# EAGLE design DC_Sensor_ESP8266_ADC_NC_08 (EAGLE 7.5.0)
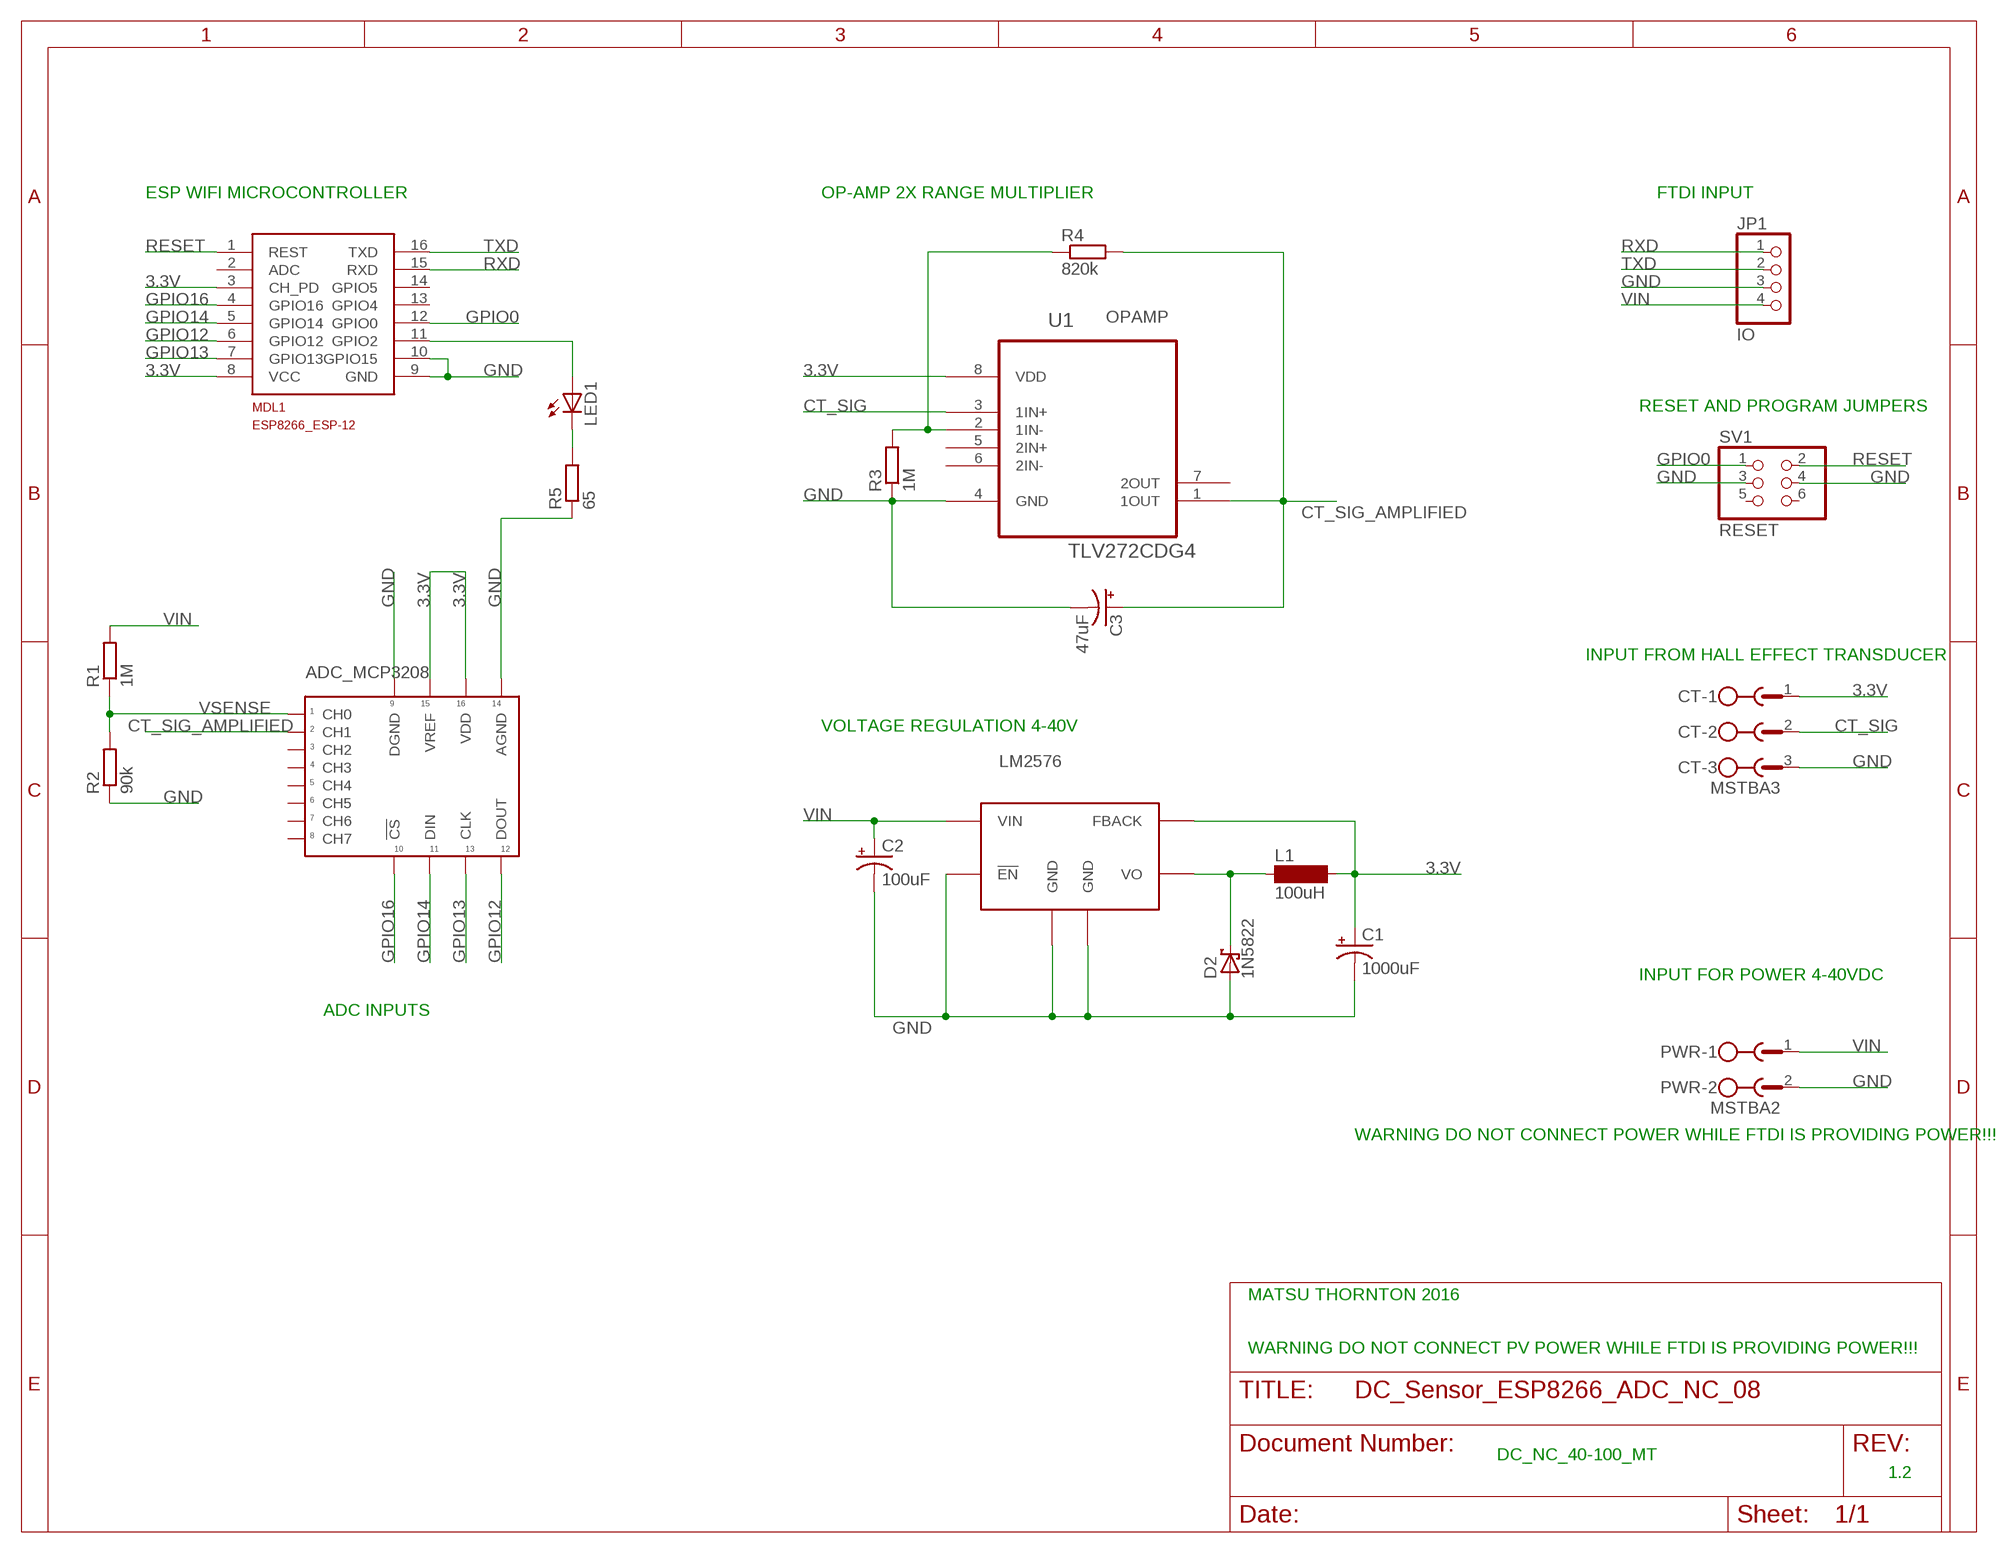
[diagram p0: schematic, sheet 1]

## Parts
ADC_MCP3208  21298ESMD  [PDIP16]
C1  1000uF  CPOL-USF  [PANASONIC_F]
C2  100uF  CPOL-USF  [PANASONIC_F]
C3  47uF  CPOL-USC  [PANASONIC_C]
CT  MSTBA3  [MSTBA3]
D2  1N5822  SCHOTTKY-DIODEC4111-15  [C4111-15]
JP1  IO  PINHD-1X4  [1X04]
L1  100uH  BS11  [BS11]
LED1  LEDCHIP-LED0603  [CHIP-LED0603]
LM2576  LM2576S  [TO263-5]
MDL1  ESP8266-12GPIO04/05_CORRECTED  [ESP8266-ESP12]
PWR  MSTBA2  [MSTBA2]
R1  1M  R-EU_R0805  [R0805]
R2  90k  R-EU_R0805  [R0805]
R3  1M  R-EU_R0805  [R0805]
R4  820k  R-EU_R0805  [R0805]
R5  65  R-EU_R0805  [R0805]
SV1  RESET  PINHD-2X3  [2X03]
U1  TLV272CDG4  [SOIC127P600X175-8N]

## Nets
3.3V: ADC_MCP3208.P$15(VREF) ADC_MCP3208.P$16(VDD) C1.+ CT.1 L1.2 LM2576.4(FBACK) MDL1.3(CH_PD) MDL1.8(VCC) U1.8(VDD)
CT_SIG: CT.2 U1.3(1IN+)
CT_SIG_AMPLIFIED: ADC_MCP3208.P$2(CH1) C3.+ R4.2 U1.1(1OUT)
GND: ADC_MCP3208.P$9(DGND) ADC_MCP3208.P$14(AGND) C1.- C2.- C3.- CT.3 D2.A JP1.3 LM2576.3(GND) LM2576.5(!EN) LM2576.TAB(GND) MDL1.9(GND) MDL1.10(GPIO15) PWR.2 R2.1 R3.1 R5.1 SV1.3 SV1.4 U1.4(GND)
GPIO0: MDL1.12(GPIO0) SV1.1
GPIO12: ADC_MCP3208.P$12(DOUT) MDL1.6(GPIO12)
GPIO13: ADC_MCP3208.P$13(CLK) MDL1.7(GPIO13)
GPIO14: ADC_MCP3208.P$11(DIN) MDL1.5(GPIO14)
GPIO16: ADC_MCP3208.P$10(!CS) MDL1.4(GPIO16)
N$1: LED1.A MDL1.11(GPIO2)
N$2: R3.2 R4.1 U1.2(1IN-)
N$3: LED1.C R5.2
N$4: D2.C L1.1 LM2576.2(VO)
RESET: MDL1.1(REST) SV1.2
RXD: JP1.1 MDL1.15(RXD)
TXD: JP1.2 MDL1.16(TXD)
VIN: C2.+ JP1.4 LM2576.1(VIN) PWR.1 R1.2
VSENSE: ADC_MCP3208.P$1(CH0) R1.1 R2.2
Unconnected: ADC_MCP3208.P$3(CH2) ADC_MCP3208.P$4(CH3) ADC_MCP3208.P$5(CH4) ADC_MCP3208.P$6(CH5) ADC_MCP3208.P$7(CH6) ADC_MCP3208.P$8(CH7) MDL1.2(ADC) MDL1.13(GPIO4) MDL1.14(GPIO5) SV1.5 SV1.6 U1.5(2IN+) U1.6(2IN-) U1.7(2OUT)

## Notes on the sheet
- ESP WIFI MICROCONTROLLER | OP-AMP 2X RANGE MULTIPLIER | FTDI INPUT
- RESET AND PROGRAM JUMPERS
- INPUT FROM HALL EFFECT TRANSDUCER
- VOLTAGE REGULATION 4-40V
- INPUT FOR POWER 4-40VDC
- ADC INPUTS
- WARNING DO NOT CONNECT POWER WHILE FTDI IS PROVIDING POWER!!!
- MATSU THORNTON 2016
- WARNING DO NOT CONNECT PV POWER WHILE FTDI IS PROVIDING POWER!!!
- DC_NC_40-100_MT
- 1.2

## Library data of the parts
ADC_MCP3208 = MCP3208:21298E
C1-C3 = rcl:CPOL-US: POLARIZED CAPACITOR, American symbol
CT = con-phoenix-508:MSTBA3: PHOENIX; MF: FARNELL; MPN: 1757255; OC_FARNELL: 3705183; OC_NEWARK: 71C4162
D2 = diode:SCHOTTKY-DIODE: Schottky Diode
JP1 = pinhead:PINHD-1X4: PIN HEADER
L1 = inductor-neosid:BS: INDUCTOR nominal inductance, magnetically screened; OC_FARNELL: unknown; OC_NEWARK: unknown
LED1 = led:LED: LED OSRAM: - CHIPLED LG R971, LG N971, LY N971, LG Q971, LY Q971, LO R971, LY R971 LH N974, LH R974 LS Q976, LO Q976, LY Q976 LO Q996 - Hyper CHIPLED LW Q18S LB Q993, LB Q99A, LB R99A - SideLED LS A670, LO A670, LY A670, LG A670, LP A670 LB A673, LV A673, LT A673, LW A673 LH A674 LY A675 LS A676, LA A676, LO A676, LY A676, LW A676 LS A679, LY A679, LG A679 - Hyper Micro SIDELED® LS Y876, LA Y876, LO Y876, LY Y876 LT Y87S - SmartLED LW L88C, LW L88S LB L89C, LB L89S, LG L890 LS L89K, LO L89K, LY L89K LS L896, LA L896, LO L896, LY L896 - TOPLED LS T670, LO T670, LY T670, LG T670, LP T670 LSG T670, LSP T670, LSY T670, LOP T670, LYG T670 LG T671, LOG T671, LSG T671 LB T673, LV T673, LT T673, LW T673 LH T674 LS T676, LA T676, LO T676, LY T676, LB T676, LH T676, LSB T676, LW T676 LB T67C, LV T67C, LT T67C, LS T67K, LO T67K, LY T67K, LW E67C LS E67B, LA E67B, LO E67B, LY E67B, LB E67C, LV E67C, LT E67C LW T67C LS T679, LY T679, LG T679 LS T770, LO T770, LY T770, LG T770, LP T770 LB T773, LV T773, LT T773, LW T773 LH T774 LS E675, LA E675, LY E675, LS T675 LS T776, LA T776, LO T776, LY T776, LB T776 LHGB T686 LT T68C, LB T68C - Hyper Mini TOPLED® LB M676 - Mini TOPLED Santana® LG M470 LS M47K, LO M47K, LY M47K Source: http://www.osram.convergy.de LUXEON: - LUMILED® LXK2-PW12-R00, LXK2-PW12-S00, LXK2-PW14-U00, LXK2-PW14-V00 LXK2-PM12-R00, LXK2-PM12-S00, LXK2-PM14-U00 LXK2-PE12-Q00, LXK2-PE12-R00, LXK2-PE12-S00, LXK2-PE14-T00, LXK2-PE14-U00 LXK2-PB12-K00, LXK2-PB12-L00, LXK2-PB12-M00, LXK2-PB14-N00, LXK2-PB14-P00, LXK2-PB14-Q00 LXK2-PR12-L00, LXK2-PR12-M00, LXK2-PR14-Q00, LXK2-PR14-R00 LXK2-PD12-Q00, LXK2-PD12-R00, LXK2-PD12-S00 LXK2-PH12-R00, LXK2-PH12-S00 LXK2-PL12-P00, LXK2-PL12-Q00, LXK2-PL12-R00 Source: www.luxeon.com KINGBRIGHT: KA-3528ASYC Source: www.kingbright.com
LM2576 = AWJLEagleLib:LM2576: Texas Instruments LM2576 Simple Switcher
MDL1 = ESP8266-ESP12:ESP8266-12: Espressif ESP8266 ESP-12 Module with GPIO04 and GPIO05 corrected.
PWR = con-phoenix-508:MSTBA2: PHOENIX; MF: FARNELL; MPN: 1757242; OC_FARNELL: 3705171; OC_NEWARK: 71C4161
R1-R5 = rcl:R-EU_: RESISTOR, European symbol
SV1 = pinhead:PINHD-2X3: PIN HEADER
U1 = Texas Instruments_By_element14_Batch_1:TLV272CDG4: OPERATIONAL AMPLIFIERS; MPN: TLV272CDG4; OC_FARNELL: 1234856; OC_NEWARK: 13M5572; PACKAGE: SOIC-8; SUPPLIER: TI; TYPE: OPAMP

## Board
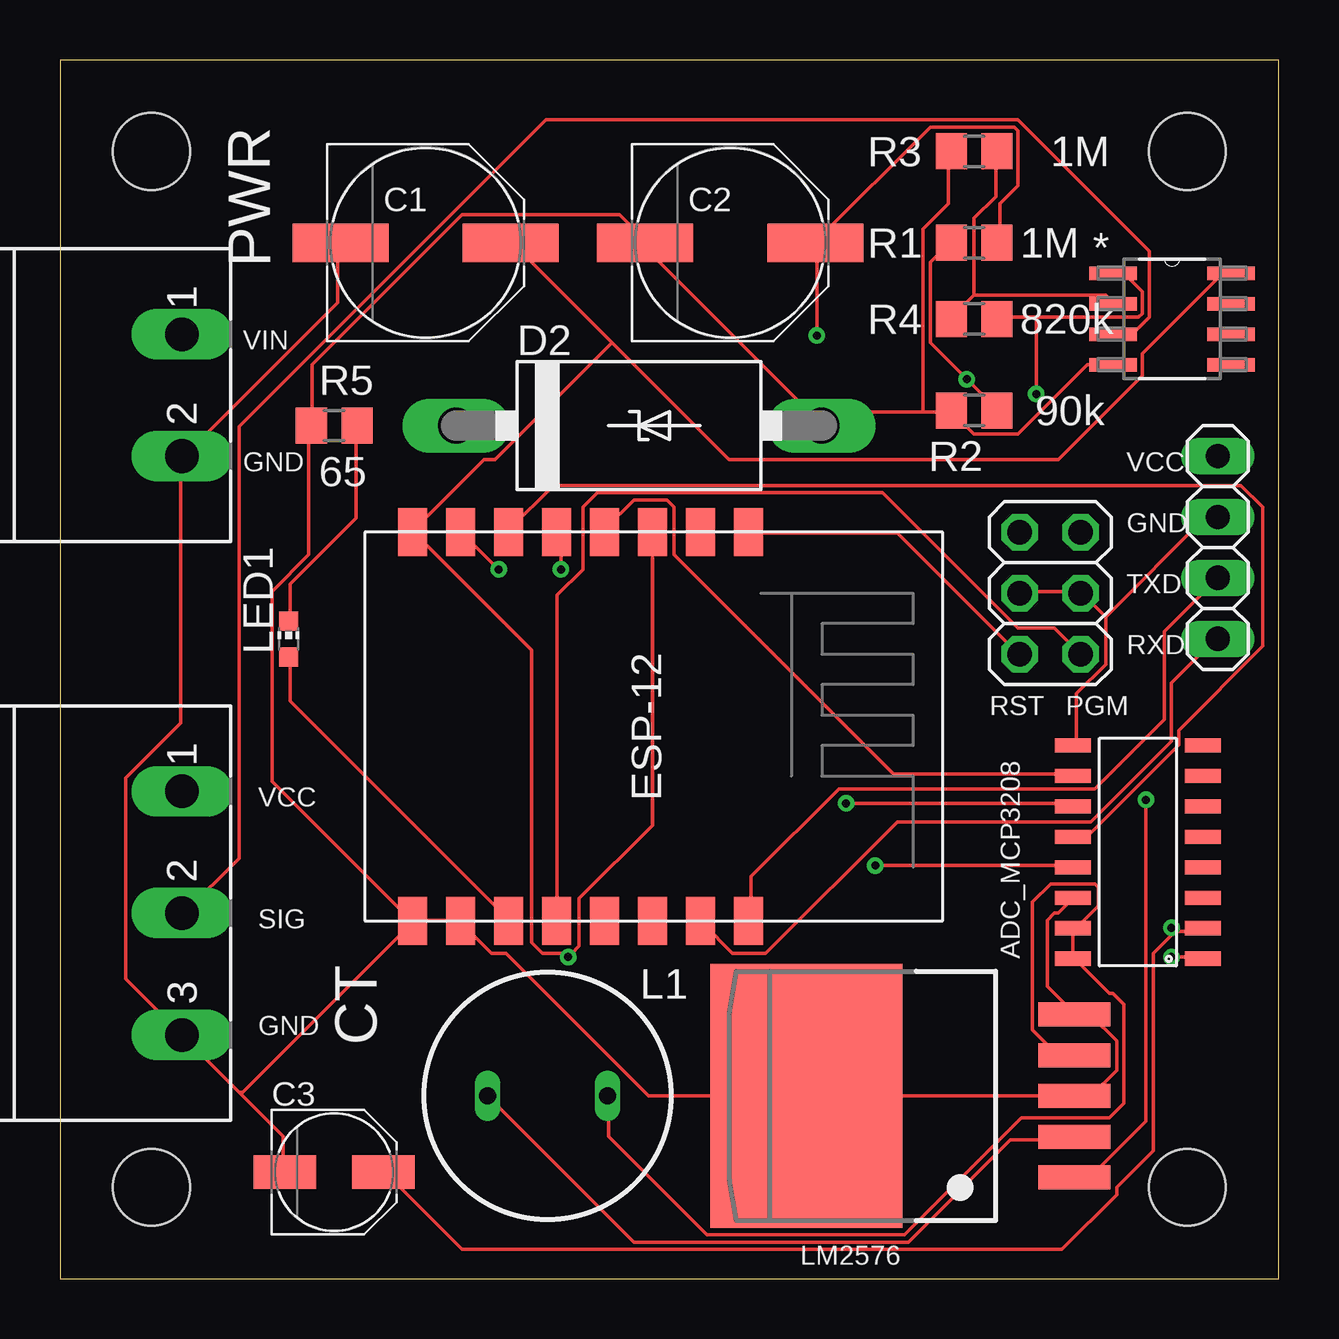
[diagram p1: board, top side]
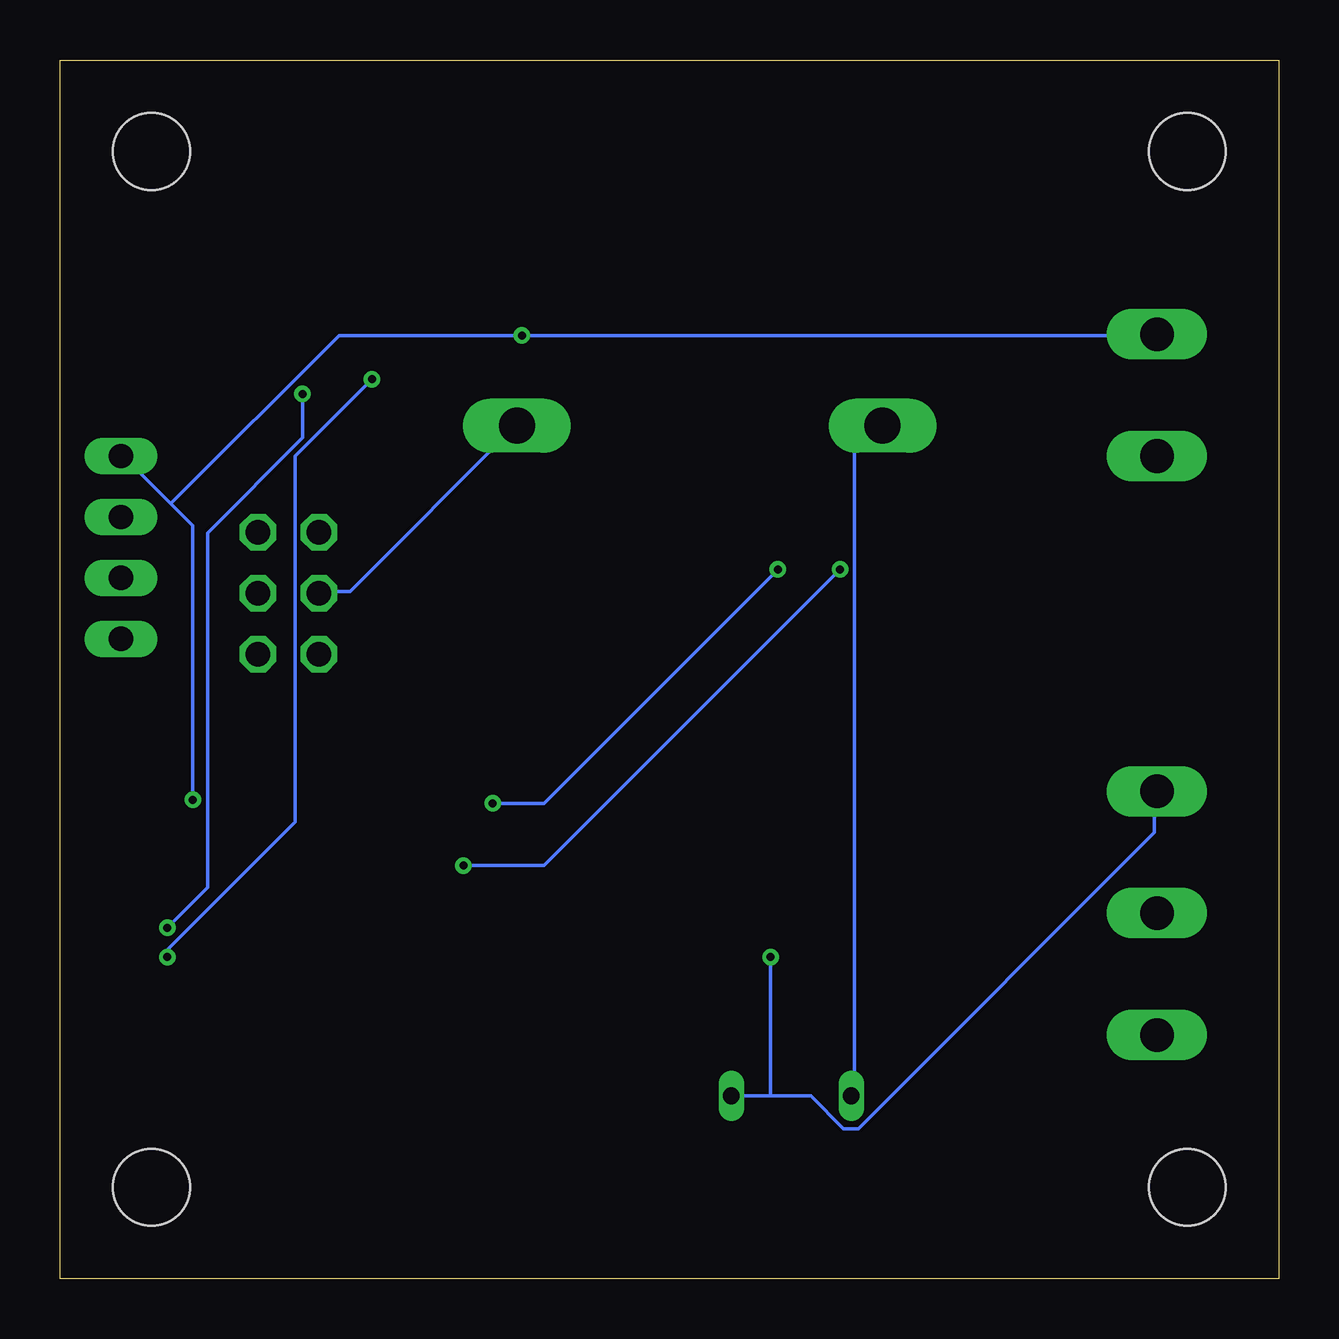
[diagram p2: board, bottom side, seen from below]

Size 50.8 x 50.8 mm. Coordinates in mm from the lower left corner, seen from the top.
Outline: 0,0 50.8,0 50.8,50.8 0,50.8 0,0
Copper layers (1*16): Top 0.0356mm / dielectric 1.5011mm / Bottom 0.0356mm
Design rules "LaenPCBOrder": minimum track width 6mil, minimum drill 13mil, track to track 6mil, track to pad 6mil, pad to pad 6mil, via to via 6mil, smd to smd 6mil, copper to edge 15mil, drill to drill 6mil, minimum pad ring 7mil, minimum via ring 7mil, stop-mask expansion 3mil, vias tented up to drill 0mil, thermal gap 10mil
Holes 3.2 mm at 3.81,46.99 46.99,46.99 46.99,3.81 3.81,3.81

### Footprints (pad centres in the part's own frame; a part is rotated, then mirrored left to right if it is on the bottom)
PDIP16 = smd 0.6 x 1.5: P$1 0,0; P$2 1.27,0; P$3 2.54,0; P$4 3.81,0; P$5 5.08,0; P$6 6.35,0; P$7 7.62,0; P$8 8.89,0; P$9 8.89,5.4; P$10 7.62,5.4; P$11 6.35,5.4; P$12 5.08,5.4; P$13 3.81,5.4; P$14 2.54,5.4; P$15 1.27,5.4; P$16 0,5.4
PANASONIC_F = smd 4 x 1.6: + 3.55,0; - -3.55,0
PANASONIC_C = smd 2.6 x 1.4: + 2.05,0; - -2.05,0
MSTBA3 = drill 1.397 long: 1 -5.08,5.08; 2 0,5.08; 3 5.08,5.08
C4111-15 = drill 1.499 long: A 7.62,0; C -7.62,0
1X04 = drill 1.016 long: 1 -3.81,0; 2 -1.27,0; 3 1.27,0; 4 3.81,0
BS11 = drill 0.7 long: 1 -2.5,0; 2 2.5,0
CHIP-LED0603 = smd 0.8 x 0.8: A 0,-0.75; C 0,0.75
TO263-5 = smd 1 x 3: 1 -3.4,-8; 2 -1.7,-8; 3 0,-8; 4 1.7,-8; 5 3.4,-8 | smd 11 x 8: TAB 0,3.175
ESP8266-ESP12 = smd 2 x 1.2: 1 0,16; 2 0,14; 3 0,12; 4 0,10; 5 0,8; 6 0,6; 7 0,4; 8 0,2; 9 16.2,2; 10 16.2,4; 11 16.2,6; 12 16.2,8; 13 16.2,10; 14 16.2,12; 15 16.2,14; 16 16.2,16
MSTBA2 = drill 1.397 long: 1 -2.54,5.08; 2 2.54,5.08
R0805 = smd 1.3 x 1.5: 1 -0.95,0; 2 0.95,0
2X03 = drill 1.016 octagon: 1 -2.54,-1.27; 2 -2.54,1.27; 3 0,-1.27; 4 0,1.27; 5 2.54,-1.27; 6 2.54,1.27
SOIC127P600X175-8N = smd 1.981 x 0.559: 1 -2.464,1.905; 2 -2.464,0.635; 3 -2.464,-0.635; 4 -2.464,-1.905; 5 2.464,-1.905; 6 2.464,-0.635; 7 2.464,0.635; 8 2.464,1.905

### Placement (x,y rotation side)
ADC_MCP3208  47.62,13.34 90 top
C1  15.24,43.18 0 top
C2  27.94,43.18 0 top
C3  11.43,4.45 0 top
CT  0,15.24 270 top
D2  24.13,35.56 0 top
JP1  48.26,30.48 90 top
L1  20.32,7.62 0 top
LED1  9.53,26.67 0 top
LM2576  34.29,7.62 90 top
MDL1  12.7,31.11 270 top
PWR  0,36.83 270 top
R1  38.1,43.18 0 top
R2  38.1,36.2 0 top
R3  38.1,46.99 0 top
R4  38.1,40.01 0 top
R5  11.43,35.56 0 top
SV1  41.27,28.57 90 top
U1  46.35,40.01 0 top

### Tracks (layer width: path | path; a pad name or v marks a point on that pad's centre or on a via)
3.3V  (via drill 0.33)
  Top 0.152: LM2576.4 42.22,9.45 41.45,9.45 40.54,10.36 40.54,15.7 41.3,16.46 43.13,16.46 43.28,16.31 43.28,15.54 42.37,14.63 ADC_MCP3208.P$15 42.22,14.48 42.22,13.41 ADC_MCP3208.P$16 42.37,13.26 43.74,11.89 43.89,11.89 44.35,11.43 44.35,7.32 43.74,6.71 40.08,6.71 35.2,1.83 26.98,1.83 22.86,5.94 22.86,7.62 L1.2 | U1.8 48.46,41.91 45.11,38.56 45.11,37.64 41.6,34.14 27.89,34.14 23.01,39.01 | 23.01,39.01 18.9,43.13 C1.+ | 23.01,39.01 18.14,34.14 17.68,34.14 14.78,31.24 MDL1.8 14.78,31.09 19.66,26.21 19.66,14.02 20.12,13.56 21.18,13.56 | 21.18,13.56 21.34,13.56 21.64,13.87 21.64,15.85 24.69,18.9 24.69,31.09 MDL1.3 | 21.18,13.56 v21.18,13.41
  Bottom 0.152: 21.18,7.62 19.51,7.62 18.14,6.25 17.53,6.25 5.18,18.59 5.18,20.27 CT.1 | 21.18,7.62 L1.2 | v21.18,13.41 21.18,7.62
CT_SIG
  Top 0.152: U1.3 43.89,39.47 44.81,39.47 45.41,40.08 45.41,42.82 39.93,48.31 20.27,48.31 7.47,35.51 7.47,17.53 5.18,15.24 CT.2
CT_SIG_AMPLIFIED  (via drill 0.33)
  Top 0.152: 40.69,40.08 44.96,40.08 45.11,40.23 45.11,41.15 44.35,41.91 U1.1 | 40.69,40.08 39.17,40.08 R4.2 | 46.48,14.48 47.55,14.48 ADC_MCP3208.P$2 | 46.48,14.48 45.57,13.56 45.57,5.33 44.04,3.81 44.04,3.5 41.76,1.22 16.76,1.22 13.56,4.42 C3.+ | v40.69,36.88 40.69,40.08 | 46.48,14.48 v46.33,14.63
  Bottom 0.152: v40.69,36.88 40.69,35.05 44.65,31.09 44.65,16.31 v46.33,14.63
GND
  Top 0.152: 43.59,27.58 43.59,25.6 42.37,24.38 42.37,22.25 ADC_MCP3208.P$9 | 43.59,27.58 42.67,28.5 SV1.3 42.52,28.65 40.08,28.65 SV1.4 | 43.59,27.58 47.7,31.7 48.16,31.7 JP1.3 | 35.97,36.12 32.31,36.12 D2.A 31.7,35.66 24.54,42.82 24.54,43.13 C2.- 24.38,43.28 23.32,44.35 16.76,44.35 10.52,38.1 10.52,35.66 R5.1 10.36,35.51 10.36,30.18 8.84,28.65 8.84,20.73 14.63,14.94 MDL1.9 | 35.97,36.12 37.03,36.12 R2.1 37.19,36.12 38.1,35.2 39.93,35.2 42.82,38.1 U1.4 | 35.97,36.12 35.97,43.74 37.03,44.81 37.03,46.94 R3.1 | ADC_MCP3208.P$14 42.22,15.85 41.6,15.24 41.45,15.24 41.15,14.94 41.15,12.19 42.22,11.12 LM2576.5 42.37,10.97 42.98,10.97 44.04,9.91 44.04,8.69 42.98,7.62 LM2576.3 LM2576.TAB 24.54,7.62 18.59,13.56 17.98,13.56 16.76,14.78 MDL1.10 16.61,14.94 14.78,14.94 MDL1.9 | C1.- 11.58,43.13 11.58,40.69 5.18,34.29 PWR.2 5.03,34.29 5.03,23.16 2.74,20.88 2.74,12.5 CT.3 7.47,7.77 | 7.47,7.77 9.3,5.94 9.3,4.57 C3.- | 7.47,7.77 7.62,7.77 14.63,14.78 MDL1.9
  Bottom 0.152: SV1.4 39.93,28.65 38.71,28.65 31.85,35.51 D2.A
GPIO0
  Top 0.152: SV1.1 41.45,27.13 39.93,27.13 34.29,32.77 22.4,32.77 21.79,32.16 21.79,29.57 20.73,28.5 20.73,14.94 MDL1.12
GPIO12
  Top 0.152: ADC_MCP3208.P$12 42.37,18.44 42.82,18.44 46.63,22.25 46.63,22.86 50.14,26.36 50.14,32.16 49.23,33.07 20.57,33.07 18.75,31.24 MDL1.6
GPIO13  (via drill 0.33)
  Top 0.152: v33.98,17.22 42.22,17.22 ADC_MCP3208.P$13 | v18.29,29.57 16.76,31.09 MDL1.7
  Bottom 0.152: v33.98,17.22 30.63,17.22 v18.29,29.57
GPIO14  (via drill 0.33)
  Top 0.152: v32.77,19.81 42.22,19.81 ADC_MCP3208.P$11 | v20.88,29.57 20.88,30.94 20.73,31.09 MDL1.5
  Bottom 0.152: v32.77,19.81 30.63,19.81 v20.88,29.57
GPIO16
  Top 0.152: ADC_MCP3208.P$10 42.22,21.03 34.75,21.03 25.6,30.18 25.6,32.16 25.3,32.46 23.93,32.46 22.71,31.24 MDL1.4
N$1
  Top 0.152: LED1.A 9.6,25.91 9.6,24.08 18.75,14.94 MDL1.11
N$2
  Top 0.152: 38.1,41 37.19,40.08 R4.1 | 38.1,41 43.59,41 43.89,40.69 U1.2 | 38.1,41 38.1,44.2 39.01,45.11 39.01,46.94 R3.2
N$3
  Top 0.152: LED1.C 9.6,27.43 9.6,28.96 12.34,31.7 12.34,35.51 R5.2
N$4
  Top 0.152: LM2576.2 42.22,5.79 39.62,5.79 35.36,1.52 23.93,1.52 L1.1
  Bottom 0.152: L1.1 17.68,7.62 17.68,34.44 16.61,35.51 D2.C
RESET
  Top 0.152: MDL1.1 28.8,31.09 34.9,31.09 39.93,26.06 SV1.2
RXD
  Top 0.152: MDL1.15 26.82,14.78 28.04,13.56 29.41,13.56 34.9,19.05 42.98,19.05 46.33,22.4 46.33,24.84 48.16,26.67 JP1.1
TXD
  Top 0.152: JP1.2 46.02,26.98 46.02,23.32 43.13,20.42 32.46,20.42 28.8,16.76 28.8,14.94 MDL1.16
VIN  (via drill 0.33)
  Top 0.152: R1.2 39.17,43.28 39.17,44.81 39.93,45.57 39.93,47.85 39.78,48.01 36.27,48.01 31.55,43.28 C2.+ 31.55,43.13 v31.55,39.32 | v45.26,19.96 45.26,6.55 42.98,4.27 42.37,4.27 LM2576.1
  Bottom 0.152: v45.26,19.96 45.26,31.39 46.18,32.31 | 46.18,32.31 48.16,34.29 JP1.4 | 46.18,32.31 39.17,39.32 v31.55,39.32 5.18,39.32 PWR.1
VSENSE  (via drill 0.33)
  Top 0.152: R2.2 39.01,36.27 v37.8,37.49 36.27,39.01 36.27,42.37 37.03,43.13 R1.1 | v46.33,13.41 47.55,13.41 ADC_MCP3208.P$1
  Bottom 0.152: v46.33,13.41 46.33,13.72 41,19.05 41,34.29 v37.8,37.49

### Text on the board
tNames: VIN | GND | VCC | GND | TXD | RXD | RST | PGM | VCC | SIG | GND